# Altium schematic sheet ESP_32_S3_Wroom.SchDoc
size A; SheetNumber: 1; SheetTotal: 5
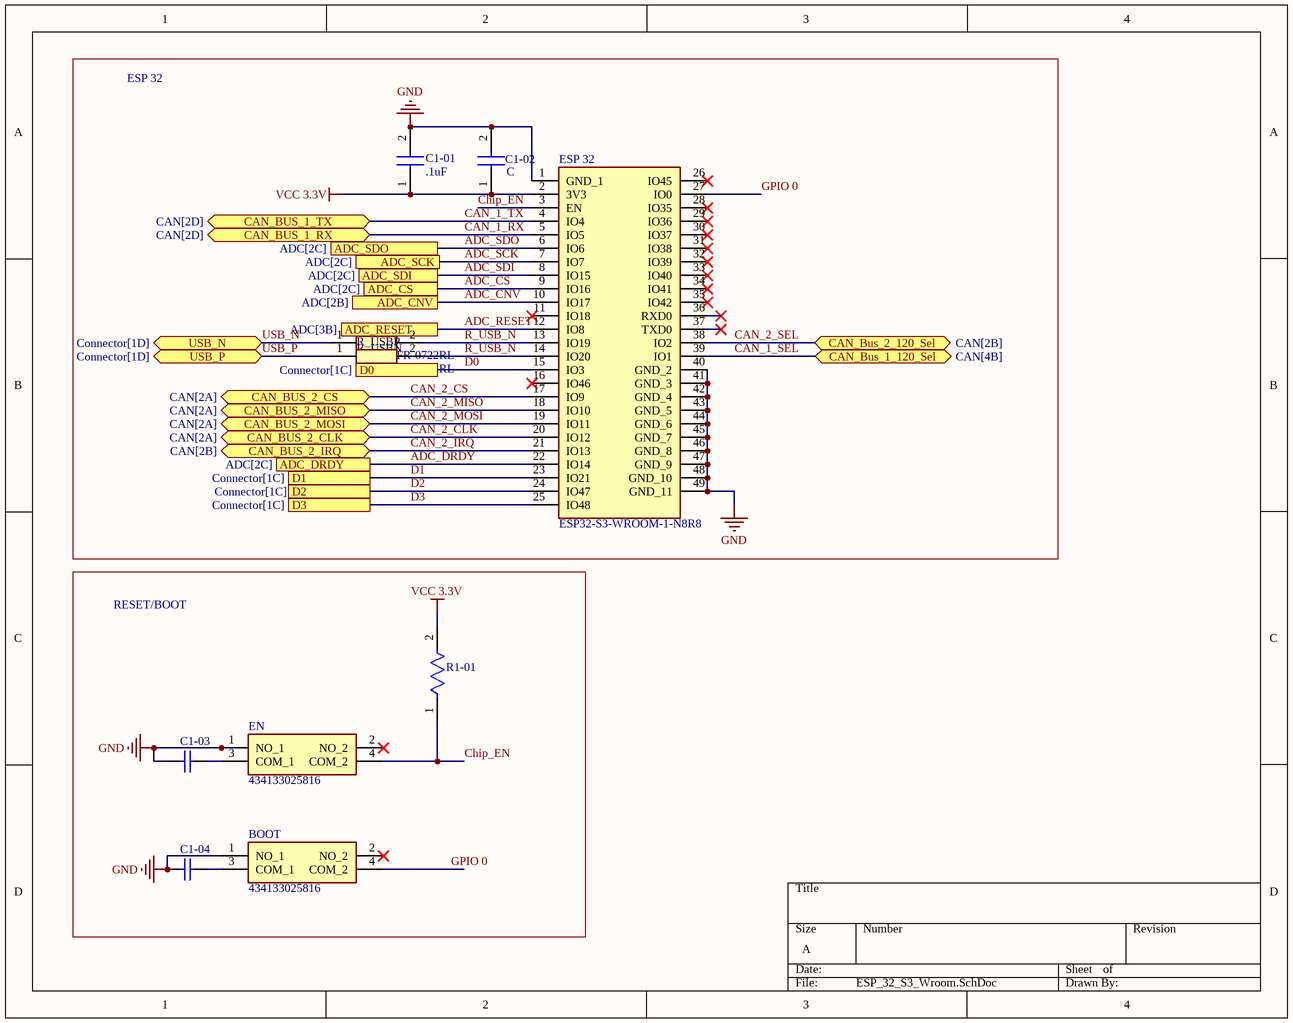
[diagram p0: ESP_32_S3_Wroom.SchDoc]

## Parts
BOOT  434133025816  [434133025816]
C1-01  .1uF  [CAPC2012X95N]
C1-02  C  [CAPC2012X145N]
C1-03  VJ0805Y393KXXPW1BC  [CAPC2013X145X50ML20T20]  (value not drawn)
C1-04  VJ0805Y393KXXPW1BC  [CAPC2013X145X50ML20T20]  (value not drawn)
EN  434133025816  [434133025816]
ESP_32  ESP32-S3-WROOM-1-N8R8  [ESP32S3WROOM1N8R8]
R1-01  CRGH0805F10K  [FP-CRGH0805-IPC_C]  (value not drawn)
R_USBN  RC0402FR-0722RL  [RESC1005X40N]
R_USBP  RC0402FR-0722RL  [RESC1005X40N]

## Blocks framed on the sheet
ESP 32: C1-01 C1-02 ESP_32 R_USBN R_USBP
RESET/BOOT: BOOT C1-03 C1-04 EN R1-01

## Ports
ADC_CNV (see ADC[2B]), ADC_CS (see ADC[2C]), ADC_DRDY (see ADC[2C]), ADC_RESET (see ADC[3B]), ADC_SCK (see ADC[2C]), ADC_SDI (see ADC[2C]), ADC_SDO (see ADC[2C]), CAN_Bus_1_120_Sel (bidir, see CAN[4B]), CAN_BUS_1_RX (bidir, see CAN[2D]), CAN_BUS_1_TX (bidir, see CAN[2D]), CAN_Bus_2_120_Sel (bidir, see CAN[2B]), CAN_BUS_2_CLK (bidir, see CAN[2A]), CAN_BUS_2_CS (bidir, see CAN[2A]), CAN_BUS_2_IRQ (bidir, see CAN[2B]), CAN_BUS_2_MISO (bidir, see CAN[2A]), CAN_BUS_2_MOSI (bidir, see CAN[2A]), D0 (see Connector[1C]), D1 (see Connector[1C]), D2 (see Connector[1C]), D3 (see Connector[1C]), USB_N (bidir, see Connector[1D]), USB_P (bidir, see Connector[1D])

## Nets
GND: BOOT.1(NO_1) C1-01.2 C1-02.2 C1-03.1 C1-04.1 EN.1(NO_1) ESP_32.1(GND_1) ESP_32.40(GND_2) ESP_32.41(GND_3) ESP_32.42(GND_4) ESP_32.43(GND_5) ESP_32.44(GND_6) ESP_32.45(GND_7) ESP_32.46(GND_8) ESP_32.47(GND_9) ESP_32.48(GND_10) ESP_32.49(GND_11)
VCC 3.3V: C1-01.1 C1-02.1 ESP_32.2(3V3) R1-01.2
ADC_CNV: ESP_32.10(IO17) ; port ADC_CNV
ADC_CS: ESP_32.9(IO16) ; port ADC_CS
ADC_DRDY: ESP_32.22(IO14) ; port ADC_DRDY
ADC_RESET: ESP_32.12(IO8) ; port ADC_RESET
ADC_SCK: ESP_32.7(IO7) ; port ADC_SCK
ADC_SDI: ESP_32.8(IO15) ; port ADC_SDI
ADC_SDO: ESP_32.6(IO6) ; port ADC_SDO
CAN_1_RX: ESP_32.5(IO5) ; port CAN_BUS_1_RX
CAN_1_SEL: ESP_32.39(IO1) ; port CAN_Bus_1_120_Sel
CAN_1_TX: ESP_32.4(IO4) ; port CAN_BUS_1_TX
CAN_2_CLK: ESP_32.20(IO12) ; port CAN_BUS_2_CLK
CAN_2_CS: ESP_32.17(IO9) ; port CAN_BUS_2_CS
CAN_2_IRQ: ESP_32.21(IO13) ; port CAN_BUS_2_IRQ
CAN_2_MISO: ESP_32.18(IO10) ; port CAN_BUS_2_MISO
CAN_2_MOSI: ESP_32.19(IO11) ; port CAN_BUS_2_MOSI
CAN_2_SEL: ESP_32.38(IO2) ; port CAN_Bus_2_120_Sel
Chip_EN: EN.4(COM_2) ESP_32.3(EN) R1-01.1
D0: ESP_32.15(IO3) ; port D0
D1: ESP_32.23(IO21) ; port D1
D2: ESP_32.24(IO47) ; port D2
D3: ESP_32.25(IO48) ; port D3
GPIO 0: BOOT.4(COM_2) ESP_32.27(IO0)
R_USB_N: ESP_32.13(IO19) ESP_32.14(IO20) R_USBN.2 R_USBP.2
USB_N: R_USBN.1 ; port USB_N
USB_P: R_USBP.1 ; port USB_P
NetBOOT_3: BOOT.3(COM_1) C1-04.2
NetC1-03_2: C1-03.2 EN.3(COM_1)

Not connected (* = marked no-connect by the designer): BOOT 2(NO_2)*; EN 2(NO_2)*; ESP_32 11(IO18)* 16(IO46)* 26(IO45)* 28(IO35)* 29(IO36)* 30(IO37)* 31(IO38)* 32(IO39)* 33(IO40)* 34(IO41)* 35(IO42)* 36(RXD0)* 37(TXD0)*

## Library data of the parts
BOOT EN = 434133025816: Switch; Manufacturer_Name: Wurth Elektronik; Datasheet Link: https://www.we-online.com/components/products/download/3D_4341x30258x6+%28rev1%29.pdf; Height: 2.5mm; Manufacturer_Part_Number: 434133025816; Mouser Part Number: 710-434133025816; Mouser Price/Stock: https://www.mouser.co.uk/ProductDetail/Wurth-Elektronik/434133025816?qs=sPbYRqrBIVmKpJ9kaO4kMw%3D%3D
C1-01 = CL21B104KBCNNNC: Capacitor; Manufacturer_Name: SAMSUNG; Datasheet Link: https://datasheet.datasheetarchive.com/originals/distributors/Datasheets_SAMA/86a3eaf0882763ef32124d5901f9b833.pdf; Height: 0.95mm; Manufacturer_Part_Number: CL21B104KBCNNNC; Mouser Part Number: 187-CL21B104KBCNNNC; Mouser Price/Stock: https://www.mouser.co.uk/ProductDetail/Samsung-Electro-Mechanics/CL21B104KBCNNNC?qs=349EhDEZ59pEfpnm5yBEmQ%3D%3D; Arrow Part Number: CL21B104KBCNNNC; Arrow Price/Stock: https://www.arrow.com/en/products/cl21b104kbcnnnc/samsung-electro-mechanics?region=europe
C1-02 = CL21A226MAYNNNE: Capacitor; Manufacturer_Name: SAMSUNG; Datasheet Link: http://product.samsungsem.com/mlcc/CL21A226MAYNNN.do; Height: 1.45mm; Manufacturer_Part_Number: CL21A226MAYNNNE; Mouser Part Number: 187-CL21A226MAYNNNE; Mouser Price/Stock: https://www.mouser.co.uk/ProductDetail/Samsung-Electro-Mechanics/CL21A226MAYNNNE?qs=xZ%2FP%252Ba9zWqY%2FVvCfXjMhqg%3D%3D; Arrow Part Number: CL21A226MAYNNNE; Arrow Price/Stock: https://www.arrow.com/en/products/cl21a226maynnne/samsung-electro-mechanics?utm_currency=USD&region=nac
C1-03 C1-04 = CMP-1036-04202-2: Manufacturer: Vitramon; Part Number: VJ0805Y393KXXPW1BC
ESP_32 = ESP32-S3-WROOM-1-N8R8: Integrated Circuit; Manufacturer_Name: Espressif Systems; Datasheet Link: https://www.espressif.com/sites/default/files/documentation/esp32-s3-wroom-1_wroom-1u_datasheet_en.pdf; Height: 3.25mm; Manufacturer_Part_Number: ESP32-S3-WROOM-1-N8R8; Mouser Part Number: 356-EP32S3WROOM1N8R8; Mouser Price/Stock: https://www.mouser.co.uk/ProductDetail/Espressif-Systems/ESP32-S3-WROOM-1-N8R8?qs=7D1LtPJG0i3%2F28hKFavOpQ%3D%3D
R1-01 = CMP-03211-003215-1: RES SMD 10K OHM 1% 1/3W 0805; Manufacturer: TE Connectivity; Power Rating: 0.33W; Value: 10kΩ; Voltage Rating: 150V; Temperature Coefficient: 100ppm/°C; ComponentLink2URL: https://www.te.com/commerce/DocumentDelivery/DDEController?Action=srchrtrv&DocNm=1773204-1&DocType=DS&DocLang=English; Device Class L1: Passive Components; Tolerance: 1%; Ipc Land Pattern Name: RESC200125X55; Digikey Description: RES SMD 10K OHM 1% 1/3W 0805; ComponentLink2Description: Datasheet; Lead Free: Yes; Octopart: https://octopart.com/crgh0805f10k-te+connectivity-24383672; Series: CRGH; Category: Res; RoHS: TRUE; Resistance: 10kΩ; Device Class L3: Chip SMD Resistors; Temperature Range Low: -55°C; Temperature Range High: +155°C; Height: 0.65mm; Package: CRGH0805; Device Class L2: Resistors; Composition: Thick Film; Temperature: -55°C to +155°C; Manufacturer Part Number: CRGH0805F10K; Automotive: No
R_USBN R_USBP = RC0402FR-0722RL: Resistor; Manufacturer_Name: KEMET; Datasheet Link: http://www.yageo.com/documents/recent/PYu-RC0402_51_RoHS_L_6_r.pdf; Height: 0.4mm; Manufacturer_Part_Number: RC0402FR-0722RL; Mouser Part Number: 603-RC0402FR-0722RL; Mouser Price/Stock: https://www.mouser.co.uk/ProductDetail/YAGEO/RC0402FR-0722RL?qs=V1yeUXFNrkkRg6zf08ADKQ%3D%3D; Arrow Part Number: RC0402FR-0722RL; Arrow Price/Stock: https://www.arrow.com/en/products/rc0402fr-0722rl/yageo